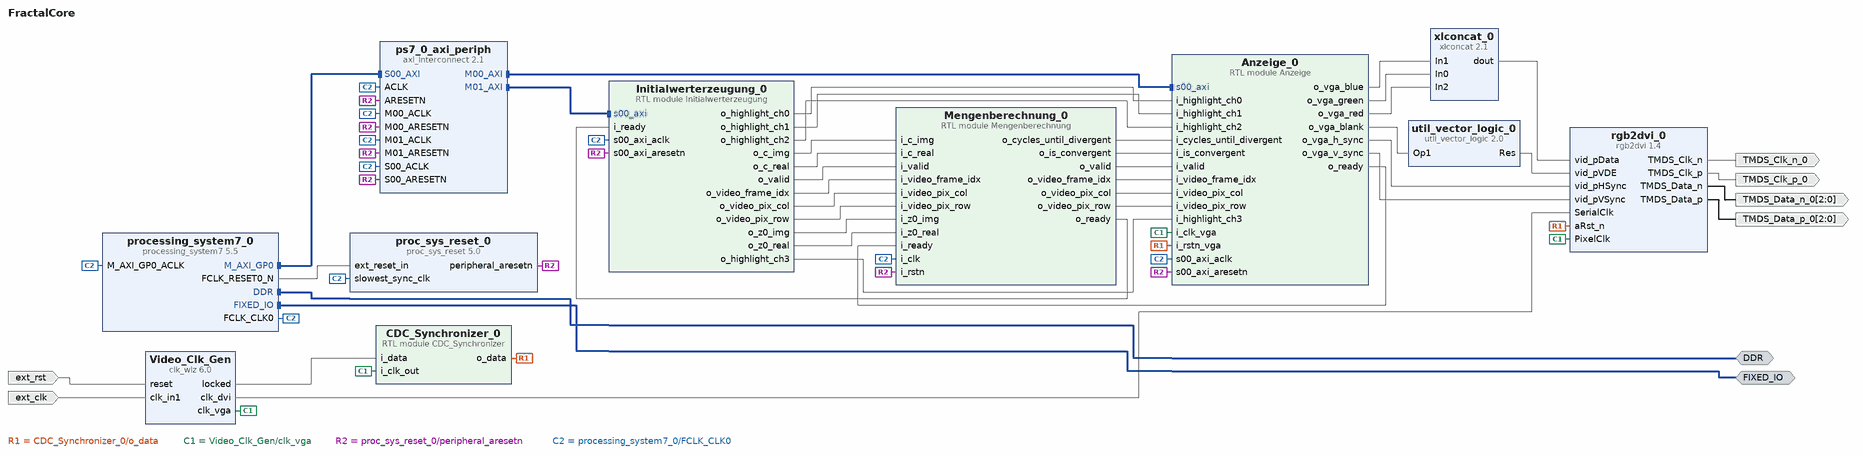
[diagram p0: block diagram of the top level]
# Vivado block design FractalCore, xc7z020clg400-1, Vivado 2023.2
create_bd_design FractalCore

create_bd_intf_port -mode Master -vlnv xilinx.com:interface:ddrx_rtl:1.0 DDR
create_bd_intf_port -mode Master -vlnv xilinx.com:display_processing_system7:fixedio_rtl:1.0 FIXED_IO
create_bd_port -dir I -type rst ext_rst
set_property -dict {CONFIG.POLARITY ACTIVE_HIGH} [get_bd_ports ext_rst]
create_bd_port -dir I -type clk ext_clk
set_property -dict {CONFIG.FREQ_HZ 125000000 CONFIG.PHASE 0.0} [get_bd_ports ext_clk]
create_bd_port -dir O -type clk TMDS_Clk_p_0
create_bd_port -dir O -type clk TMDS_Clk_n_0
create_bd_port -dir O -from 2 -to 0 TMDS_Data_p_0
create_bd_port -dir O -from 2 -to 0 TMDS_Data_n_0

create_bd_cell -type ip -vlnv xilinx.com:ip:processing_system7:5.5 processing_system7_0
set_property -dict [list \
  CONFIG.PCW_APU_PERIPHERAL_FREQMHZ 650 \
  CONFIG.PCW_CRYSTAL_PERIPHERAL_FREQMHZ 50 \
  CONFIG.PCW_ENET0_ENET0_IO {MIO 16 .. 27} \
  CONFIG.PCW_ENET0_GRP_MDIO_ENABLE 1 \
  CONFIG.PCW_ENET0_GRP_MDIO_IO {MIO 52 .. 53} \
  CONFIG.PCW_ENET0_PERIPHERAL_ENABLE 1 \
  CONFIG.PCW_ENET0_RESET_ENABLE 1 \
  CONFIG.PCW_ENET0_RESET_IO {MIO 9} \
  CONFIG.PCW_ENET_RESET_ENABLE 1 \
  CONFIG.PCW_ENET_RESET_SELECT {Share reset pin} \
  CONFIG.PCW_FPGA0_PERIPHERAL_FREQMHZ 100 \
  CONFIG.PCW_FPGA1_PERIPHERAL_FREQMHZ 50 \
  CONFIG.PCW_GPIO_MIO_GPIO_ENABLE 1 \
  CONFIG.PCW_GPIO_MIO_GPIO_IO MIO \
  CONFIG.PCW_I2C_RESET_ENABLE 0 \
  CONFIG.PCW_M_AXI_GP0_FREQMHZ 10 \
  CONFIG.PCW_PERIPHERAL_BOARD_PRESET None \
  CONFIG.PCW_PRESET_BANK1_VOLTAGE {LVCMOS 1.8V} \
  CONFIG.PCW_QSPI_GRP_FBCLK_ENABLE 1 \
  CONFIG.PCW_QSPI_GRP_FBCLK_IO {MIO 8} \
  CONFIG.PCW_QSPI_GRP_SINGLE_SS_ENABLE 1 \
  CONFIG.PCW_QSPI_GRP_SINGLE_SS_IO {MIO 1 .. 6} \
  CONFIG.PCW_QSPI_PERIPHERAL_ENABLE 1 \
  CONFIG.PCW_QSPI_QSPI_IO {MIO 1 .. 6} \
  CONFIG.PCW_SD0_GRP_CD_ENABLE 1 \
  CONFIG.PCW_SD0_GRP_CD_IO {MIO 47} \
  CONFIG.PCW_SD0_GRP_WP_ENABLE 0 \
  CONFIG.PCW_SD0_PERIPHERAL_ENABLE 1 \
  CONFIG.PCW_SD0_SD0_IO {MIO 40 .. 45} \
  CONFIG.PCW_SDIO_PERIPHERAL_FREQMHZ 50 \
  CONFIG.PCW_SINGLE_QSPI_DATA_MODE x4 \
  CONFIG.PCW_UART0_PERIPHERAL_ENABLE 1 \
  CONFIG.PCW_UART0_UART0_IO {MIO 14 .. 15} \
  CONFIG.PCW_UART1_PERIPHERAL_ENABLE 0 \
  CONFIG.PCW_UART_PERIPHERAL_FREQMHZ 100 \
  CONFIG.PCW_UIPARAM_DDR_BUS_WIDTH {16 Bit} \
  CONFIG.PCW_UIPARAM_DDR_FREQ_MHZ 525 \
  CONFIG.PCW_UIPARAM_DDR_PARTNO {MT41J256M16 RE-125} \
  CONFIG.PCW_USB0_PERIPHERAL_ENABLE 1 \
  CONFIG.PCW_USB0_RESET_ENABLE 1 \
  CONFIG.PCW_USB0_RESET_IO {MIO 46} \
  CONFIG.PCW_USB0_USB0_IO {MIO 28 .. 39} \
  CONFIG.PCW_USB_RESET_ENABLE 1 \
  CONFIG.PCW_USB_RESET_SELECT {Share reset pin} \
  CONFIG.preset None \
] [get_bd_cells processing_system7_0]
# 497 more settings of processing_system7_0 are not shown: defaults, MIO pin electricals, DDR timing, and values the tool derives
create_bd_cell -type ip -vlnv xilinx.com:ip:proc_sys_reset:5.0 proc_sys_reset_0
create_bd_cell -type ip -vlnv xilinx.com:ip:clk_wiz:6.0 Video_Clk_Gen
set_property -dict [list \
  CONFIG.CLKIN1_JITTER_PS 80.0 \
  CONFIG.CLKOUT1_DRIVES BUFG \
  CONFIG.CLKOUT1_JITTER 165.419 \
  CONFIG.CLKOUT1_PHASE_ERROR 96.948 \
  CONFIG.CLKOUT1_REQUESTED_OUT_FREQ 25.0 \
  CONFIG.CLKOUT2_DRIVES BUFG \
  CONFIG.CLKOUT2_JITTER 119.348 \
  CONFIG.CLKOUT2_PHASE_ERROR 96.948 \
  CONFIG.CLKOUT2_REQUESTED_OUT_FREQ 125.0 \
  CONFIG.CLKOUT2_USED true \
  CONFIG.CLKOUT3_DRIVES BUFG \
  CONFIG.CLKOUT4_DRIVES BUFG \
  CONFIG.CLKOUT5_DRIVES BUFG \
  CONFIG.CLKOUT6_DRIVES BUFG \
  CONFIG.CLKOUT7_DRIVES BUFG \
  CONFIG.CLK_IN1_BOARD_INTERFACE Custom \
  CONFIG.CLK_OUT1_PORT clk_vga \
  CONFIG.CLK_OUT2_PORT clk_dvi \
  CONFIG.FEEDBACK_SOURCE FDBK_AUTO \
  CONFIG.MMCM_BANDWIDTH OPTIMIZED \
  CONFIG.MMCM_CLKFBOUT_MULT_F 8.000 \
  CONFIG.MMCM_CLKIN1_PERIOD 8.000 \
  CONFIG.MMCM_CLKIN2_PERIOD 10.000 \
  CONFIG.MMCM_CLKOUT0_DIVIDE_F 40.000 \
  CONFIG.MMCM_CLKOUT1_DIVIDE 8 \
  CONFIG.MMCM_COMPENSATION ZHOLD \
  CONFIG.MMCM_DIVCLK_DIVIDE 1 \
  CONFIG.NUM_OUT_CLKS 2 \
  CONFIG.PRIMITIVE MMCM \
  CONFIG.PRIM_IN_FREQ 125.000 \
  CONFIG.USE_BOARD_FLOW true \
] [get_bd_cells Video_Clk_Gen]
create_bd_cell -type module -reference CDC_Synchronizer CDC_Synchronizer_0
create_bd_cell -type module -reference Initialwerterzeugung Initialwerterzeugung_0
create_bd_cell -type module -reference Mengenberechnung Mengenberechnung_0
create_bd_cell -type ip -vlnv xilinx.com:ip:xlconcat:2.1 xlconcat_0
set_property -dict {CONFIG.IN0_WIDTH 8 CONFIG.IN1_WIDTH 8 CONFIG.IN2_WIDTH 8 CONFIG.NUM_PORTS 3} [get_bd_cells xlconcat_0]
create_bd_cell -type ip -vlnv xilinx.com:ip:util_vector_logic:2.0 util_vector_logic_0
set_property -dict {CONFIG.C_OPERATION not CONFIG.C_SIZE 1} [get_bd_cells util_vector_logic_0]
create_bd_cell -type ip -vlnv xilinx.com:ip:axi_interconnect:2.1 ps7_0_axi_periph
set_property -dict {CONFIG.NUM_MI 2} [get_bd_cells ps7_0_axi_periph]
create_bd_cell -type module -reference Anzeige Anzeige_0
create_bd_cell -type ip -vlnv digilentinc.com:ip:rgb2dvi:1.4 rgb2dvi_0
set_property -dict {CONFIG.kGenerateSerialClk false CONFIG.kRstActiveHigh false} [get_bd_cells rgb2dvi_0]

# ---- connections ----

connect_bd_intf_net [get_bd_intf_ports DDR] [get_bd_intf_pins processing_system7_0/DDR]
connect_bd_intf_net [get_bd_intf_ports FIXED_IO] [get_bd_intf_pins processing_system7_0/FIXED_IO]
connect_bd_intf_net [get_bd_intf_pins processing_system7_0/M_AXI_GP0] [get_bd_intf_pins ps7_0_axi_periph/S00_AXI]
connect_bd_intf_net [get_bd_intf_pins ps7_0_axi_periph/M00_AXI] [get_bd_intf_pins Anzeige_0/s00_axi]
connect_bd_intf_net [get_bd_intf_pins ps7_0_axi_periph/M01_AXI] [get_bd_intf_pins Initialwerterzeugung_0/s00_axi]
connect_bd_net [get_bd_pins Anzeige_0/o_ready] [get_bd_pins Mengenberechnung_0/i_ready]
connect_bd_net [get_bd_pins Anzeige_0/o_vga_blank] [get_bd_pins util_vector_logic_0/Op1]
connect_bd_net [get_bd_pins Anzeige_0/o_vga_blue] [get_bd_pins xlconcat_0/In1]
connect_bd_net [get_bd_pins Anzeige_0/o_vga_green] [get_bd_pins xlconcat_0/In0]
connect_bd_net [get_bd_pins Anzeige_0/o_vga_h_sync] [get_bd_pins rgb2dvi_0/vid_pHSync]
connect_bd_net [get_bd_pins Anzeige_0/o_vga_red] [get_bd_pins xlconcat_0/In2]
connect_bd_net [get_bd_pins Anzeige_0/o_vga_v_sync] [get_bd_pins rgb2dvi_0/vid_pVSync]
connect_bd_net [get_bd_pins CDC_Synchronizer_0/o_data] [get_bd_pins Anzeige_0/i_rstn_vga] [get_bd_pins rgb2dvi_0/aRst_n]
connect_bd_net [get_bd_pins Initialwerterzeugung_0/o_c_img] [get_bd_pins Mengenberechnung_0/i_c_img]
connect_bd_net [get_bd_pins Initialwerterzeugung_0/o_c_real] [get_bd_pins Mengenberechnung_0/i_c_real]
connect_bd_net [get_bd_pins Initialwerterzeugung_0/o_highlight_ch0] [get_bd_pins Anzeige_0/i_highlight_ch0]
connect_bd_net [get_bd_pins Initialwerterzeugung_0/o_highlight_ch1] [get_bd_pins Anzeige_0/i_highlight_ch1]
connect_bd_net [get_bd_pins Initialwerterzeugung_0/o_highlight_ch2] [get_bd_pins Anzeige_0/i_highlight_ch2]
connect_bd_net [get_bd_pins Initialwerterzeugung_0/o_highlight_ch3] [get_bd_pins Anzeige_0/i_highlight_ch3]
connect_bd_net [get_bd_pins Initialwerterzeugung_0/o_valid] [get_bd_pins Mengenberechnung_0/i_valid]
connect_bd_net [get_bd_pins Initialwerterzeugung_0/o_video_frame_idx] [get_bd_pins Mengenberechnung_0/i_video_frame_idx]
connect_bd_net [get_bd_pins Initialwerterzeugung_0/o_video_pix_col] [get_bd_pins Mengenberechnung_0/i_video_pix_col]
connect_bd_net [get_bd_pins Initialwerterzeugung_0/o_video_pix_row] [get_bd_pins Mengenberechnung_0/i_video_pix_row]
connect_bd_net [get_bd_pins Initialwerterzeugung_0/o_z0_img] [get_bd_pins Mengenberechnung_0/i_z0_img]
connect_bd_net [get_bd_pins Initialwerterzeugung_0/o_z0_real] [get_bd_pins Mengenberechnung_0/i_z0_real]
connect_bd_net [get_bd_pins Mengenberechnung_0/o_cycles_until_divergent] [get_bd_pins Anzeige_0/i_cycles_until_divergent]
connect_bd_net [get_bd_pins Mengenberechnung_0/o_is_convergent] [get_bd_pins Anzeige_0/i_is_convergent]
connect_bd_net [get_bd_pins Mengenberechnung_0/o_ready] [get_bd_pins Initialwerterzeugung_0/i_ready]
connect_bd_net [get_bd_pins Mengenberechnung_0/o_valid] [get_bd_pins Anzeige_0/i_valid]
connect_bd_net [get_bd_pins Mengenberechnung_0/o_video_frame_idx] [get_bd_pins Anzeige_0/i_video_frame_idx]
connect_bd_net [get_bd_pins Mengenberechnung_0/o_video_pix_col] [get_bd_pins Anzeige_0/i_video_pix_col]
connect_bd_net [get_bd_pins Mengenberechnung_0/o_video_pix_row] [get_bd_pins Anzeige_0/i_video_pix_row]
connect_bd_net [get_bd_pins Video_Clk_Gen/clk_dvi] [get_bd_pins rgb2dvi_0/SerialClk]
connect_bd_net -net clk_wiz_0_clk_vga [get_bd_pins Video_Clk_Gen/clk_vga] \
  [get_bd_pins CDC_Synchronizer_0/i_clk_out] [get_bd_pins Anzeige_0/i_clk_vga] [get_bd_pins rgb2dvi_0/PixelClk]
connect_bd_net -net clk_wiz_0_locked [get_bd_pins Video_Clk_Gen/locked] [get_bd_pins CDC_Synchronizer_0/i_data]
connect_bd_net [get_bd_pins proc_sys_reset_0/peripheral_aresetn] \
  [get_bd_pins ps7_0_axi_periph/S00_ARESETN] [get_bd_pins ps7_0_axi_periph/M00_ARESETN] \
  [get_bd_pins ps7_0_axi_periph/ARESETN] [get_bd_pins ps7_0_axi_periph/M01_ARESETN] [get_bd_pins Anzeige_0/s00_axi_aresetn] \
  [get_bd_pins Initialwerterzeugung_0/s00_axi_aresetn] [get_bd_pins Mengenberechnung_0/i_rstn]
connect_bd_net [get_bd_pins processing_system7_0/FCLK_CLK0] \
  [get_bd_pins processing_system7_0/M_AXI_GP0_ACLK] [get_bd_pins proc_sys_reset_0/slowest_sync_clk] \
  [get_bd_pins ps7_0_axi_periph/ACLK] [get_bd_pins ps7_0_axi_periph/S00_ACLK] [get_bd_pins ps7_0_axi_periph/M00_ACLK] \
  [get_bd_pins ps7_0_axi_periph/M01_ACLK] [get_bd_pins Anzeige_0/s00_axi_aclk] \
  [get_bd_pins Initialwerterzeugung_0/s00_axi_aclk] [get_bd_pins Mengenberechnung_0/i_clk]
connect_bd_net [get_bd_pins processing_system7_0/FCLK_RESET0_N] [get_bd_pins proc_sys_reset_0/ext_reset_in]
connect_bd_net -net reset_0_1 [get_bd_ports ext_rst] [get_bd_pins Video_Clk_Gen/reset]
connect_bd_net [get_bd_pins rgb2dvi_0/TMDS_Clk_n] [get_bd_ports TMDS_Clk_n_0]
connect_bd_net [get_bd_pins rgb2dvi_0/TMDS_Clk_p] [get_bd_ports TMDS_Clk_p_0]
connect_bd_net [get_bd_pins rgb2dvi_0/TMDS_Data_n] [get_bd_ports TMDS_Data_n_0]
connect_bd_net [get_bd_pins rgb2dvi_0/TMDS_Data_p] [get_bd_ports TMDS_Data_p_0]
connect_bd_net -net sys_clock_1 [get_bd_ports ext_clk] [get_bd_pins Video_Clk_Gen/clk_in1]
connect_bd_net [get_bd_pins util_vector_logic_0/Res] [get_bd_pins rgb2dvi_0/vid_pVDE]
connect_bd_net [get_bd_pins xlconcat_0/dout] [get_bd_pins rgb2dvi_0/vid_pData]

# ---- address map ----
assign_bd_address -offset 0x40000000 -range 4K -target_address_space [get_bd_addr_spaces processing_system7_0/Data] [get_bd_addr_segs Anzeige_0/s00_axi/reg0]
assign_bd_address -offset 0x40001000 -range 4K -target_address_space [get_bd_addr_spaces processing_system7_0/Data] [get_bd_addr_segs Initialwerterzeugung_0/s00_axi/reg0]

validate_bd_design
save_bd_design
